# Altium schematic sheet Pmod, Grove and Qwiic Connections.SchDoc
size A3; Company Name: Renesas Electronics America; CompanyURL: www.renesas.com; PageSetup: Record=PageOptions|CenterHorizontal=True|CenterVertical=True|PrintScale=1.00|XCorrection=1.00|YCorrection=1.00|PrintKind=1|BorderSize=5000000|LeftOffset=0|BottomOffset=0|Orientation=2|PaperLength=1000|PaperWidth=1000|Scale=100|PaperSource=7|PrintQuality=-4|MediaType=1|DitherType=10|PaperKind=A5 148x210mm|PrintScaleMode=1; ReleaseDate: 16.09.2025; Version: MP; SheetNumber: 7; SheetTotal: 18; VariantNumber: 0; DSheetNumber: 1
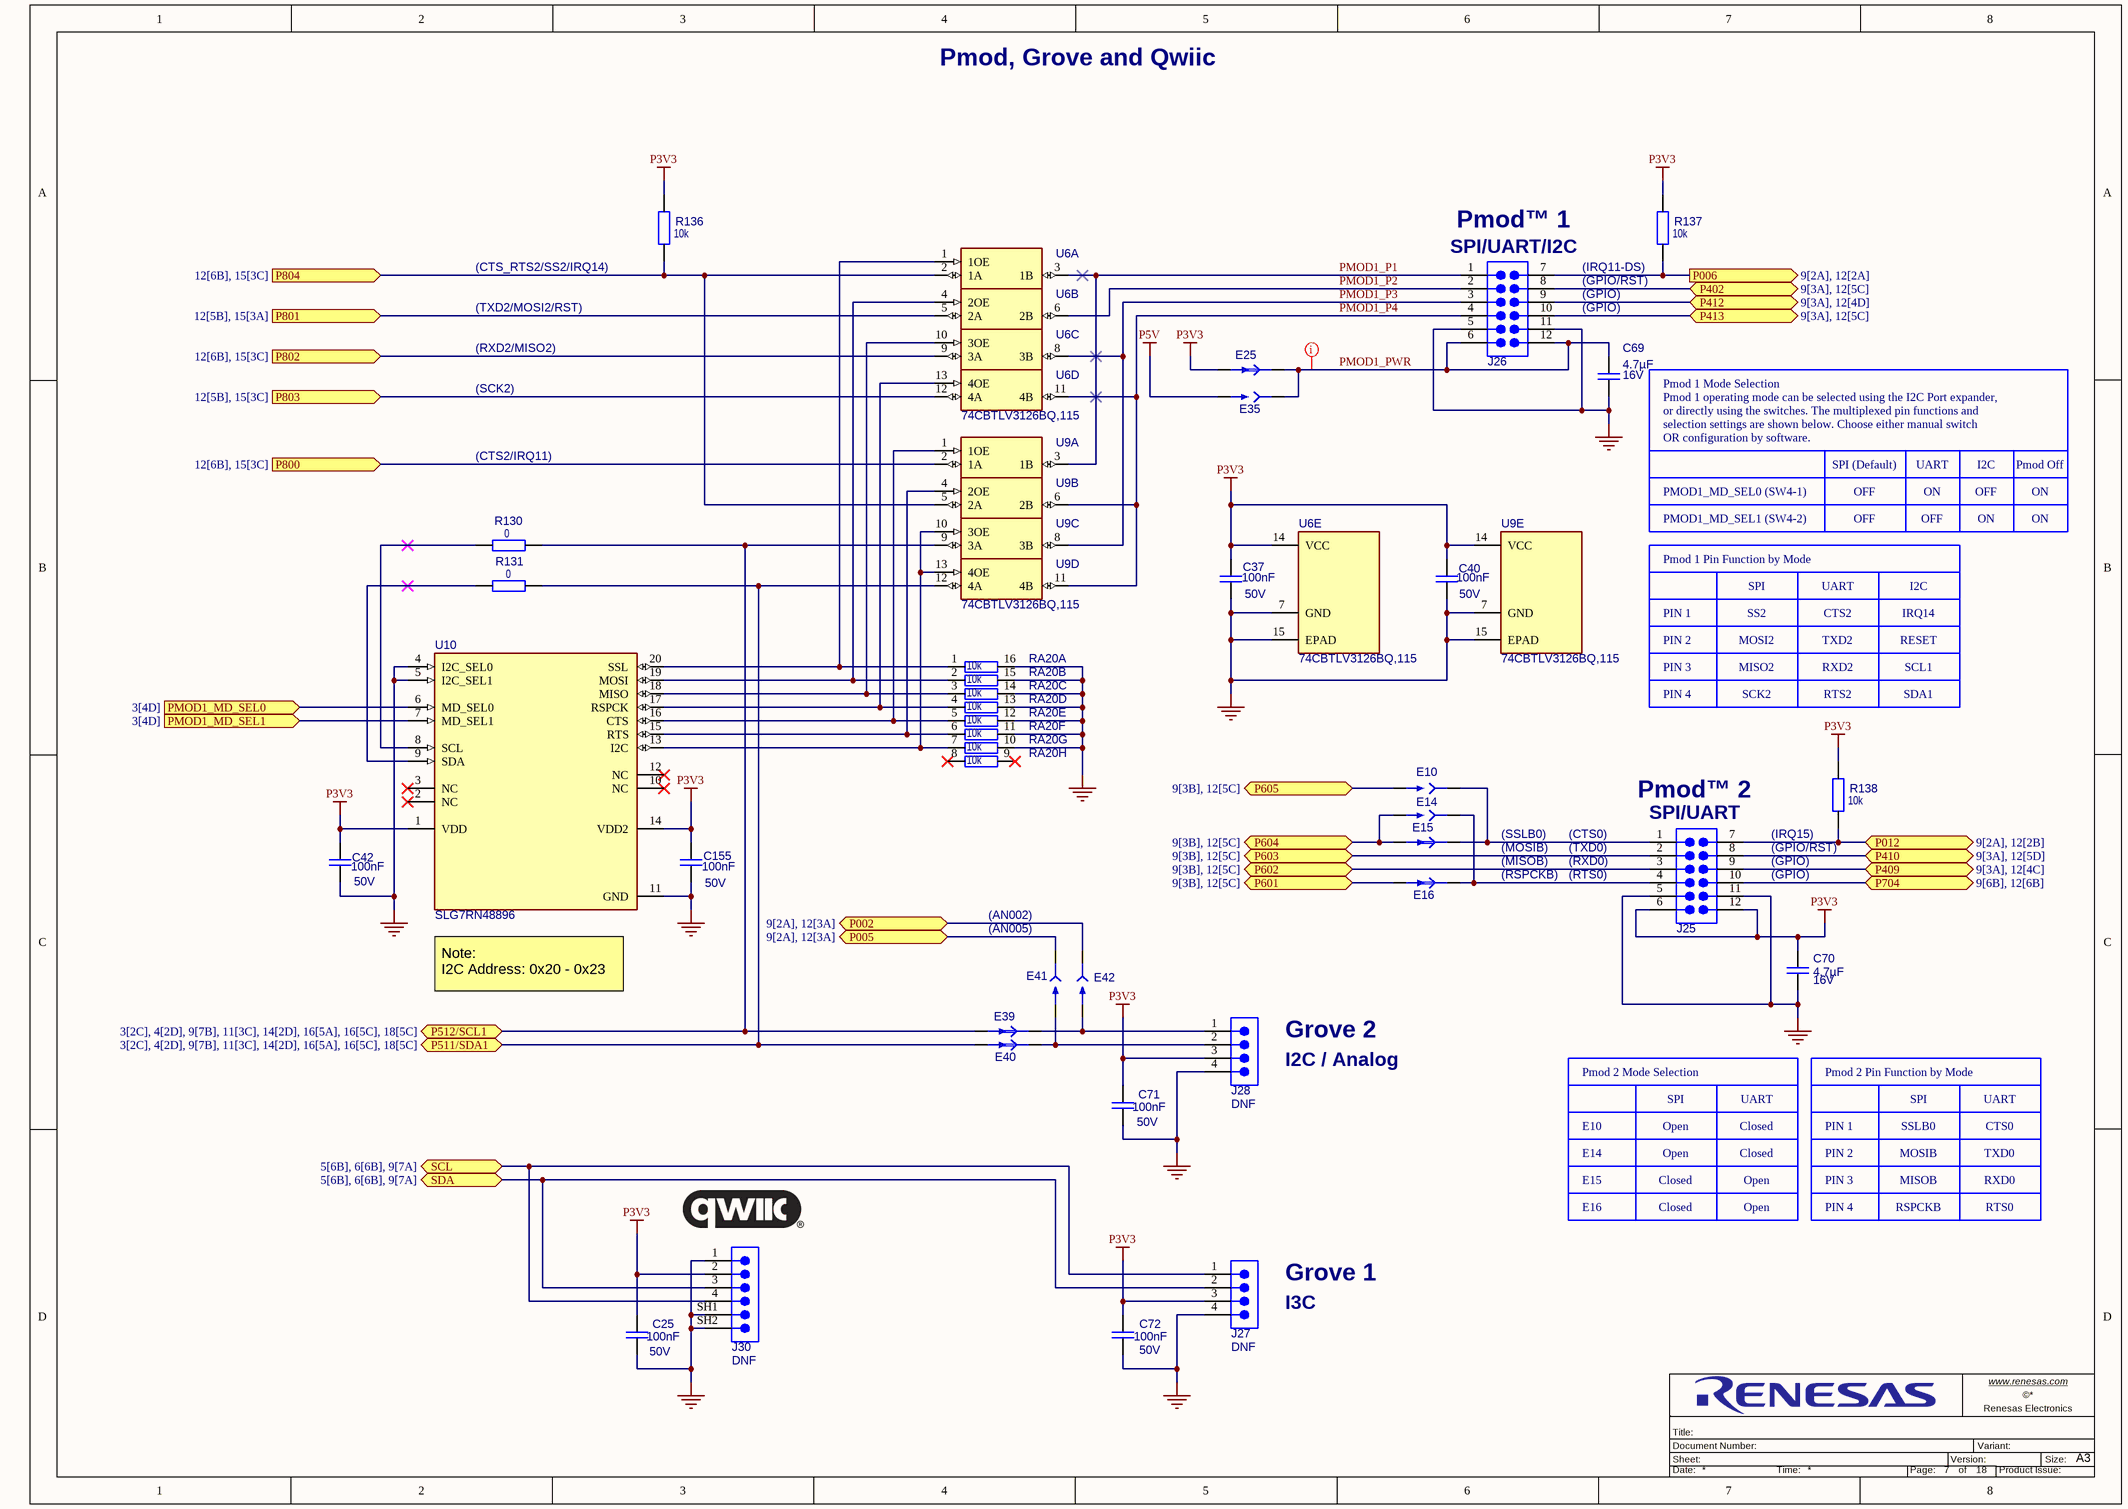
[diagram p0: Pmod, Grove and Qwiic Connections.SchDoc]

## Parts
C25  value 100nF  Operating Voltage Max: 50V  [C_EIA0402_0p55]  (hidden comment: Capacitor)
C37  value 100nF  Operating Voltage Max: 50V  [C_EIA0402_0p55]  (hidden comment: Capacitor)
C40  value 100nF  Operating Voltage Max: 50V  [C_EIA0402_0p55]  (hidden comment: Capacitor)
C42  value 100nF  Operating Voltage Max: 50V  [C_EIA0402_0p55]  (hidden comment: Capacitor)
C69  value 4.7µF  Operating Voltage Max: 16V  [C_EIA0603_1p0]  (hidden comment: Capacitor)
C70  value 4.7µF  Operating Voltage Max: 16V  [C_EIA0603_1p0]  (hidden comment: Capacitor)
C71  value 100nF  Operating Voltage Max: 50V  [C_EIA0402_0p55]  (hidden comment: Capacitor)
C72  value 100nF  Operating Voltage Max: 50V  [C_EIA0402_0p55]  (hidden comment: Capacitor)
C155  value 100nF  Operating Voltage Max: 50V  [C_EIA0402_0p55]  (hidden comment: Capacitor)
E10  SOLDER_BRIDGE_0805  [solder_bridge_0805]  (value not drawn)  (no BOM)
E14  SOLDER_BRIDGE_0805  [solder_bridge_0805]  (value not drawn)  (no BOM)
E15  TRACE_CUT_0805  [trace_cut_0805]  (value not drawn)  (net tie, no BOM)
E16  TRACE_CUT_0805  [trace_cut_0805]  (value not drawn)  (net tie, no BOM)
E25  TRACE_CUT_0805  [trace_cut_0805]  (value not drawn)  (net tie, no BOM)
E35  SOLDER_BRIDGE_0805  [solder_bridge_0805]  (value not drawn)  (no BOM)
E39  TRACE_CUT_0805  [trace_cut_0805]  (value not drawn)  (net tie, no BOM)
E40  TRACE_CUT_0805  [trace_cut_0805]  (value not drawn)  (net tie, no BOM)
E41  SOLDER_BRIDGE_0805  [solder_bridge_0805]  (value not drawn)  (no BOM)
E42  SOLDER_BRIDGE_0805  [solder_bridge_0805]  (value not drawn)  (no BOM)
J25  SMH-106-02-L-D  [sam_SMH-106-02-LD_PMOD]  (value not drawn)
J26  SMH-106-02-L-D  [sam_SMH-106-02-LD_PMOD]  (value not drawn)
J27  110990037  [sed_110990037]  (value not drawn)
J28  110990037  [sed_110990037]  (value not drawn)
J30  SM04B-SRSS-TB(LF)(SN)  [jst_SM04B-SRSS-TB(LF)(SN)]  (value not drawn)
R130  value 0  [R_EIA0402]  (hidden comment: Resistor)
R131  value 0  [R_EIA0402]  (hidden comment: Resistor)
R136  value 10k  [R_EIA0402]  (hidden comment: Resistor)
R137  value 10k  [R_EIA0402]  (hidden comment: Resistor)
R138  value 10k  [R_EIA0402]  (hidden comment: Resistor)
RA20  value 10k  [R_Array_EIA1506]  (hidden comment: EXB-2HV103JV)  (parts A,B,C,D,E,F,G,H of 8)
U6  74CBTLV3126BQ,115  [nex_DHVQFN14_SOT-762-1_MO-241]  (value not drawn)  (parts A,B,C,D,E of 5)
U9  74CBTLV3126BQ,115  [nex_DHVQFN14_SOT-762-1_MO-241]  (value not drawn)  (parts A,B,C,D,E of 5)
U10  SLG7RN48896  [ren_STQFN-20_2x3]

## Ports
P002 (bidir, see 9[2A], 12[3A]), P005 (bidir, see 9[2A], 12[3A]), P006 (out, see 9[2A], 12[2A]), P012 (bidir, see 9[2A], 12[2B]), P402 (bidir, see 9[3A], 12[5C]), P409 (bidir, see 9[3A], 12[4C]), P410 (bidir, see 9[3A], 12[5D]), P412 (bidir, see 9[3A], 12[4D]), P413 (bidir, see 9[3A], 12[5C]), P511/SDA1 (bidir, see 3[2C], 4[2D], 9[7B], 11[3C], 14[2D], 16[5A], 16[5C], 18[5C]), P512/SCL1 (bidir, see 3[2C], 4[2D], 9[7B], 11[3C], 14[2D], 16[5A], 16[5C], 18[5C]), P601 (bidir, see 9[3B], 12[5C]), P602 (bidir, see 9[3B], 12[5C]), P603 (bidir, see 9[3B], 12[5C]), P604 (bidir, see 9[3B], 12[5C]), P605 (bidir, see 9[3B], 12[5C]), P704 (bidir, see 9[6B], 12[6B]), P800 (in, see 12[6B], 15[3C]), P801 (in, see 12[5B], 15[3A]), P802 (in, see 12[6B], 15[3C]), P803 (in, see 12[5B], 15[3C]), P804 (in, see 12[6B], 15[3C]), PMOD1_MD_SEL0 (in, see 3[4D]), PMOD1_MD_SEL1 (in, see 3[4D]), SCL (bidir, see 5[6B], 6[6B], 9[7A]), SDA (bidir, see 5[6B], 6[6B], 9[7A])

## Nets
GND: C25.1 C37.1 C40.1 C42.1 C69.2 C70.2 C71.1 C72.1 C155.1 J25.5 J25.11 J26.5 J26.11 J27.4 J28.4 J30.1 J30.SH1(SH2) J30.SH2 RA20.10 RA20.11 RA20.12 RA20.13 RA20.14 RA20.15 RA20.16 U6.7(GND) U6.15(EPAD) U9.7(GND) U9.15(EPAD) U10.4(I2C_SEL0) U10.5(I2C_SEL1) U10.11(GND)
P3V3: C25.2 C37.2 C40.2 C42.2 C70.1 C71.2 C72.2 C155.2 E25.2 J25.6 J25.12 J27.3 J28.3 J30.2 R136.2 R137.2 R138.2 U6.14(VCC) U9.14(VCC) U10.1(VDD) U10.14(VDD2)
P5V: E35.2
P002: E42.1 ; port P002
P005: E41.1 ; port P005
P006: J26.7 R137.1 ; port P006
P012: J25.7 R138.1 ; port P012
P402: J26.8 ; port P402
P409: J25.9 ; port P409
P410: J25.8 ; port P410
P412: J26.9 ; port P412
P413: J26.10 ; port P413
P511/SDA1: E40.2 R131.1 U9.12(4A) ; port P511/SDA1
P512/SCL1: E39.2 R130.1 U9.9(3A) ; port P512/SCL1
P601: E16.2 ; port P601
P602: J25.3 ; port P602
P603: J25.2 ; port P603
P604: E14.2 E15.2 ; port P604
P605: E10.2 ; port P605
P704: J25.10 ; port P704
P800: U9.2(1A) ; port P800
P801: U6.5(2A) ; port P801
P802: U6.9(3A) ; port P802
P803: U6.12(4A) ; port P803
P804: R136.1 U6.2(1A) U9.5(2A) ; port P804
PMOD1_MD_SEL0: U10.6(MD_SEL0) ; port PMOD1_MD_SEL0
PMOD1_MD_SEL1: U10.7(MD_SEL1) ; port PMOD1_MD_SEL1
PMOD1_P1: J26.1 U6.3(1B) U9.3(1B)
PMOD1_P2: J26.2 U6.6(2B)
PMOD1_P3: J26.3 U6.8(3B) U9.8(3B)
PMOD1_P4: J26.4 U6.11(4B) U9.6(2B) U9.11(4B)
PMOD1_PWR: C69.1 E25.1 E35.1 J26.6 J26.12
SCL: J27.1 J30.4 ; port SCL
SDA: J27.2 J30.3 ; port SDA
NetE10_1: E10.1 E15.1 J25.1
NetE14_1: E14.1 E16.1 J25.4
NetE39_1: E39.1 E42.2 J28.1
NetE40_1: E40.1 E41.2 J28.2
NetR130_2: R130.2 U10.8(SCL)
NetR131_2: R131.2 U10.9(SDA)
NetRA20_1: RA20.1 U6.1(1OE) U10.20(SSL)
NetRA20_2: RA20.2 U6.4(2OE) U10.19(MOSI)
NetRA20_3: RA20.3 U6.10(3OE) U10.18(MISO)
NetRA20_4: RA20.4 U6.13(4OE) U10.17(RSPCK)
NetRA20_5: RA20.5 U9.1(1OE) U10.16(CTS)
NetRA20_6: RA20.6 U9.4(2OE) U10.15(RTS)
NetRA20_7: RA20.7 U9.10(3OE) U9.13(4OE) U10.13(I2C)

Not connected (* = marked no-connect by the designer): RA20 8* 9*; U10 2(NC)* 3(NC)* 10(NC)* 12(NC)*

## Layout directives
net class Power: PMOD1_PWR

## Notes on the sheet
- Pmod, Grove and Qwiic
- (near J26) Pmod™ 1
- (CTS_RTS2/SS2/IRQ14)
- (TXD2/MOSI2/RST)
- (near J26) SPI/UART/I2C
- (near R137) (IRQ11-DS)
- (GPIO/RST)
- (GPIO)
- (RXD2/MISO2)
- Pmod 1 Mode Selection
- (SCK2)
- Pmod 1 operating mode can be selected using the I2C Port expander,
- or directly using the switches. The multiplexed pin functions and
- selection settings are shown below. Choose either manual switch
- OR configuration by software.
- (CTS2/IRQ11)
- PMOD1_MD_SEL0 (SW4-1)
- PMOD1_MD_SEL1 (SW4-2)
- SPI (Default)
- OFF
- UART
- ON
- I2C
- Pmod Off
- Pmod 1 Pin Function by Mode
- SPI
- PIN 1
- PIN 2
- SS2
- MOSI2
- CTS2
- TXD2
- IRQ14
- RESET
- PIN 3
- PIN 4
- MISO2
- SCK2
- RXD2
- RTS2
- SCL1
- SDA1
- (SSLB0)
- (MOSIB)
- (CTS0)
- (TXD0)
- (near J25) Pmod™ 2
- (near J25) SPI/UART
- (near R138) (IRQ15)
- (near R138) (GPIO/RST)
- (AN002)
- (MISOB)
- (RSPCKB)
- (RXD0)
- (RTS0)
- (near U10) Note:
  I2C Address: 0x20 - 0x23
- (AN005)
- Grove 2
- I2C / Analog
- Pmod 2 Mode Selection
- E10
- Open
- Closed
- Pmod 2 Pin Function by Mode
- SSLB0
- CTS0
- E14
- E15
- MOSIB
- MISOB
- TXD0
- RXD0
- E16
- RSPCKB
- RTS0
- Grove 1
- I3C
- www.renesas.com <http://www.renesas.com>
- Sheet:
- Title:
- Document Number:
- Version:
- Variant:
- Renesas Electronics
- Size:
- A3
- Date:
- Time:
- Page:
- of
- Product Issue:

## Library data of the parts
C25 C37 C40 C42 C71 C72 C155 = CAP-00003203-9: Capacitor,EIA0402,100n,50V,X7R; Tolerance: 10%; Qualification: AEC-Q200; Subtype: MLCC; Dielectric: X7R; Height: 550µm; Operating Temperature Max: 125°C; Operating Temperature Min: -55°C
C69 C70 = CAP-00003210-8: Capacitor,EIA0603,4.7u,16V,X7S; Tolerance: 10%; Qualification: AEC-Q200; Subtype: MLCC; Dielectric: X7S; Height: 1mm; Operating Temperature Max: 125°C; Operating Temperature Min: -55°C
E10 E14 E35 E41 E42 = MIS-00000002-7: Solder Bridge, SMD, 0805 size; Value: SB; Subtype: Solder Bridge; Qualification: -; Pin Count: 2
E15 E16 E25 E39 E40 = MIS-00000000-11: Trace Cut, SMD, 0805 size; Value: TC; Pin Count: 2; Qualification: -; Subtype: Trace Cut
J25 J26 = CON-00000060-6: Socket,12way,2row,horizontal,2.54mm,SMD,PMOD_Interface; Gender: female; Qualification: -; Operating Temperature Max: 125°C; Pin Count: 12; Height: 4.95mm; Operating Temperature Min: -55°C
J27 J28 = CON-00000062-4: Grove Header,4Way,1 Row, Horizontal,2mm,THT; Current: 1.5A; Gender: male; Operating Voltage Max: 100V; Qualification: -; Operating Temperature Min: -25°C; Pin Count: 4; Height: 5.1mm; Operating Temperature Max: 85°C; DNF: DNF
J30 = CON-00000061-3: Wire-to-Board Header,4way, Single Row, Right-Angle, SMD; DC Resistance: 20m; Gender: female; Current: 1A; Operating Voltage Max: 50V; Height: 3mm; Qualification: -; Operating Temperature Max: 85°C; Pin Count: 6; Operating Temperature Min: -25°C; DNF: DNF
R130 R131 = RES-00000801-9: Resistor,EIA0402,0,0.0625W; Power: 62.5mW; Tolerance: 5%; Subtype: Chip Resistor; Operating Temperature Max: 155°C; Operating Temperature Min: -55°C; Qualification: -
R136-R138 = RES-00000902-9: Resistor,EIA0402,10k,0.0625W; Power: 62.5mW; Tolerance: 1%; Subtype: Chip Resistor; Operating Temperature Max: 155°C; Operating Temperature Min: -55°C; Qualification: -
RA20 = RES-00003208-7: Resistor Network & Array,EIA1506,10k,0.063W; Subtype: Resistor Array; Qualification: AEC-Q200; Operating Voltage Max: 50V; Tolerance: 5%; Power: 62.5mW; Operating Temperature Min: -55°C; Height: 550µm; Operating Temperature Max: 125°C
U6 U9 = ICS-00000034-10: Bus Driver, 4-Func, 1-Bit, True Output, CMOS, DHVQN14, SOT762-1; Frequency: 406MHz; Subtype: Digital; Current: 100mA; Power: 500mW; Operating Voltage Min: 2.3V; Operating Voltage Max: 3.6V; Pin Count: 15; Operating Temperature Min: -40°C; Qualification: -; Operating Temperature Max: 125°C
U10 = ICS-00000194-3: Renesas GreenPak PMOD mode controller; Operating Voltage Min: 3V; Operating Voltage Max: 3.6V; Subtype: Digital; Pin Count: 20; Qualification: -; Operating Temperature Max: 35°C; Operating Temperature Min: 15°C